# EAGLE design uv-exposure-box-main (EAGLE 6.4)
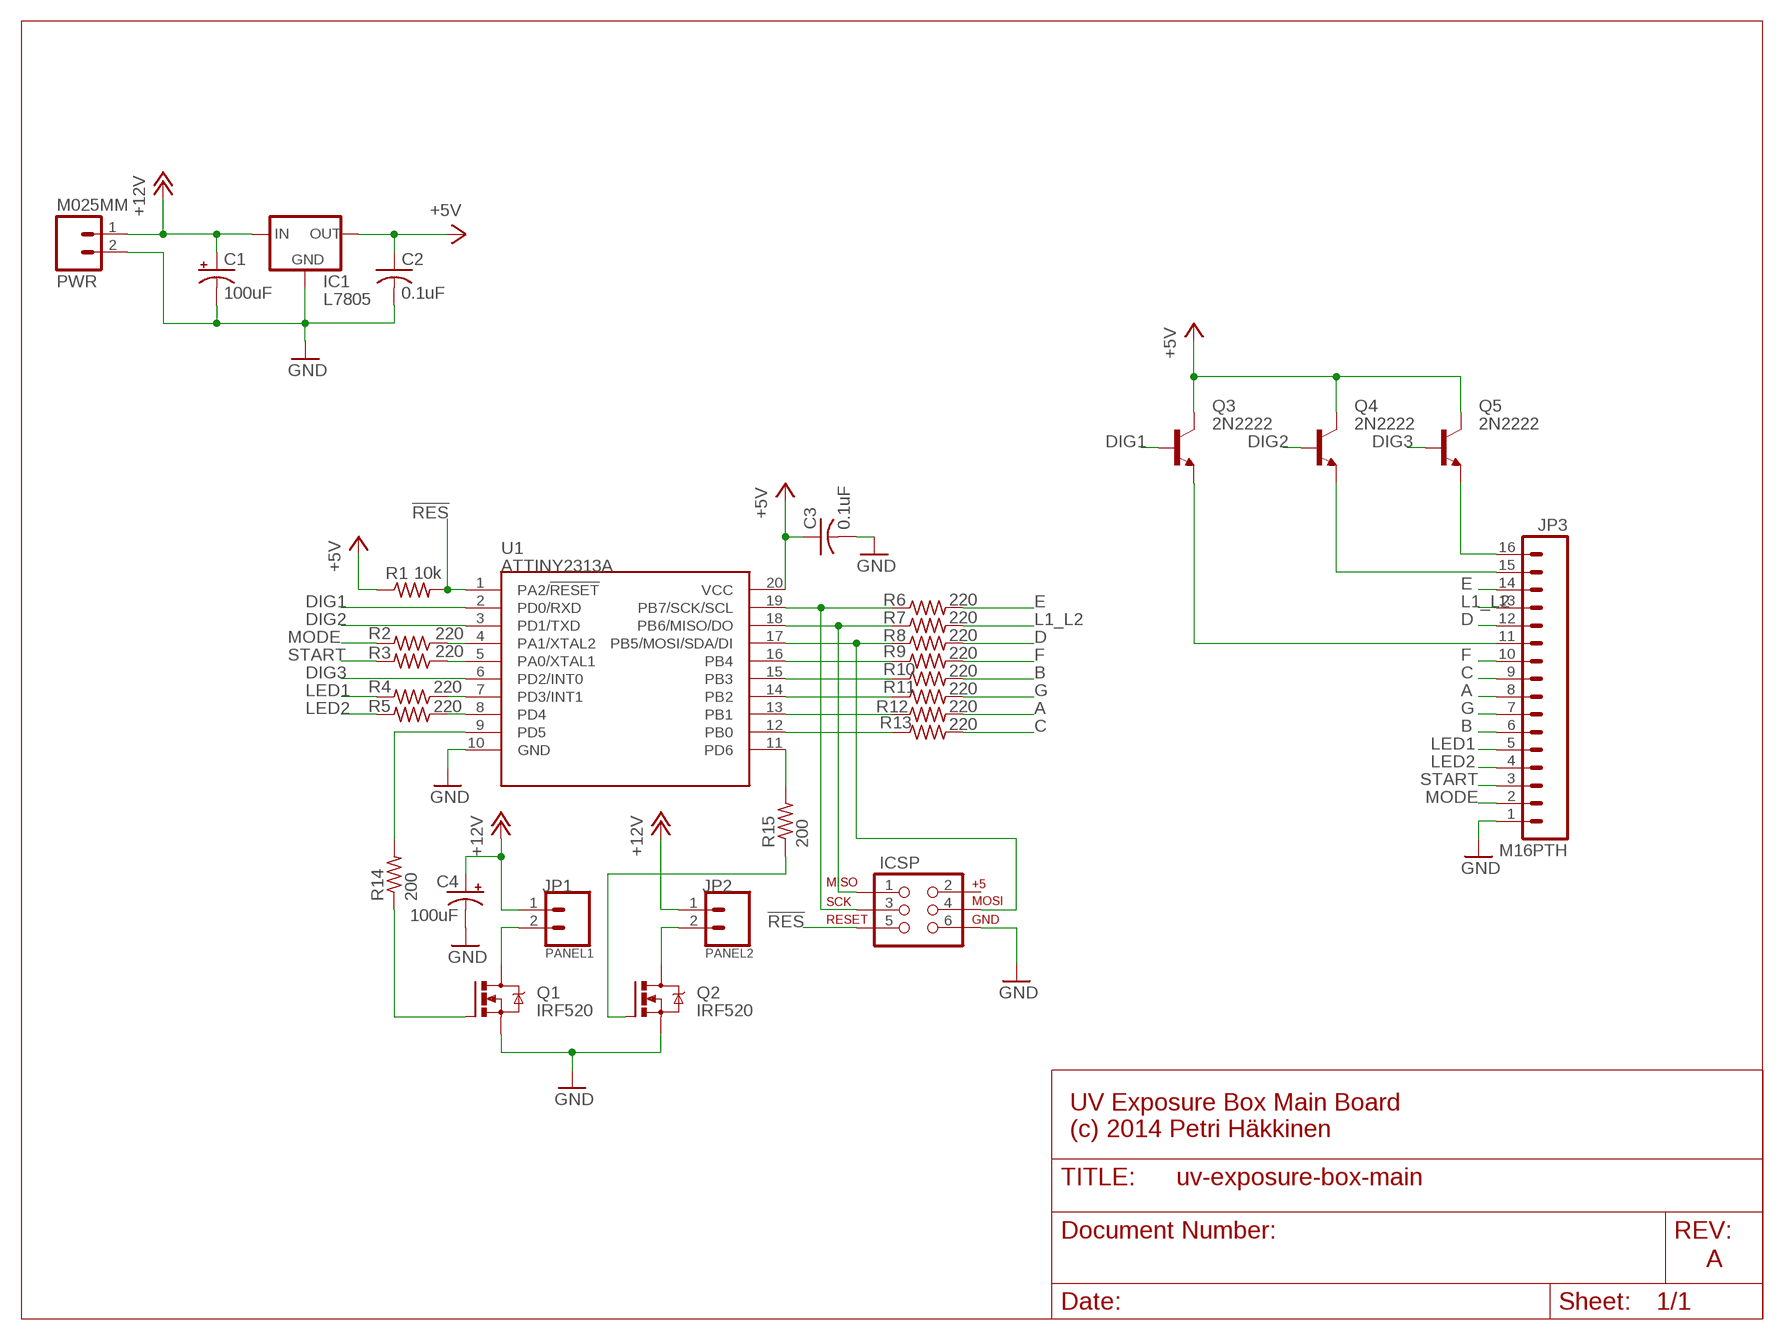
[diagram p0: schematic, sheet 1]

## Parts
C1  100uF  CPOL-USE2.5-5  [E2,5-5]
C2  0.1uF  C-US025-024X044  [C025-024X044]
C3  0.1uF  C-US025-024X044  [C025-024X044]
C4  100uF  CPOL-USE2.5-5  [E2,5-5]
IC1  L7805  V_REG_78XXV  [TO220-IGO]
ICSP  AVR_SPI_PRG_6PTH  [2X3]
JP1  M025MM  [SCREWTERMINAL-5MM-2]
JP2  M025MM  [SCREWTERMINAL-5MM-2]
JP3  M16PTH  [1X16]
PWR  M025MM  [SCREWTERMINAL-5MM-2]
Q1  IRF520  [TO220BV]
Q2  IRF520  [TO220BV]
Q3  2N2222  2N2222-NPN-TO92-EBC  [TO92-EBC]
Q4  2N2222  2N2222-NPN-TO92-EBC  [TO92-EBC]
Q5  2N2222  2N2222-NPN-TO92-EBC  [TO92-EBC]
R1  10k  R-US_0207/10  [0207/10]
R2  220  R-US_0207/10  [0207/10]
R3  220  R-US_0207/10  [0207/10]
R4  220  R-US_0207/10  [0207/10]
R5  220  R-US_0207/10  [0207/10]
R6  220  R-US_0207/10  [0207/10]
R7  220  R-US_0207/10  [0207/10]
R8  220  R-US_0207/10  [0207/10]
R9  220  R-US_0207/10  [0207/10]
R10  220  R-US_0207/10  [0207/10]
R11  220  R-US_0207/10  [0207/10]
R12  220  R-US_0207/10  [0207/10]
R13  220  R-US_0207/10  [0207/10]
R14  200  R-US_0207/10  [0207/10]
R15  200  R-US_0207/10  [0207/10]
U1  ATTINY2313A  ATTINY2313ADIL20  [DIL20]

## Nets
!RES: ICSP.5 R1.2 U1.1(PA2/!RESET)
+5V: C2.1 C3.1 IC1.OUT Q3.C Q4.C Q5.C R1.1 U1.20(VCC)
+12V: C1.+ C4.+ IC1.IN JP1.1 JP2.1 PWR.1
A: JP3.8 R12.2
B: JP3.6 R10.2
C: JP3.9 R13.2
D: JP3.12 R8.2
DIG1: Q3.B U1.2(PD0/RXD)
DIG2: Q4.B U1.3(PD1/TXD)
DIG3: Q5.B U1.6(PD2/INT0)
E: JP3.14 R6.2
F: JP3.10 R9.2
G: JP3.7 R11.2
GND: C1.- C2.2 C3.2 C4.- IC1.GND ICSP.6 JP3.1 PWR.2 Q1.S Q2.S U1.10(GND)
L1_L2: JP3.13 R7.2
LED1: JP3.5 R4.2
LED2: JP3.4 R5.2
MODE: JP3.2 R2.2
N$1: R2.1 U1.4(PA1/XTAL2)
N$2: R3.1 U1.5(PA0/XTAL1)
N$3: JP3.11 Q3.E
N$4: JP3.15 Q4.E
N$5: JP3.16 Q5.E
N$6: Q1.G R14.1
N$7: R15.2 U1.11(PD6)
N$9: ICSP.3 R6.1 U1.19(PB7/SCK/SCL)
N$10: ICSP.1 R7.1 U1.18(PB6/MISO/DO)
N$11: ICSP.4 R8.1 U1.17(PB5/MOSI/SDA/DI)
N$12: R9.1 U1.16(PB4)
N$13: R10.1 U1.15(PB3)
N$14: R11.1 U1.14(PB2)
N$15: R12.1 U1.13(PB1)
N$16: R13.1 U1.12(PB0)
N$26: R4.1 U1.7(PD3/INT1)
N$27: R5.1 U1.8(PD4)
N$28: R14.2 U1.9(PD5)
N$29: JP1.2 Q1.D
N$30: Q2.G R15.1
N$31: JP2.2 Q2.D
START: JP3.3 R3.2
Unconnected: ICSP.2

## Notes on the sheet
- PANEL1 | PANEL2
- UV Exposure Box Main Board
  (c) 2014 Petri Häkkinen
- A

## Library data of the parts
C1 C4 = resistor:CPOL-US: POLARIZED CAPACITOR, American symbol
C2 C3 = resistor:C-US: CAPACITOR, American symbol
IC1 = PetenPaja:V_REG_78XX: Voltage Regulator Standard 7805 5V regulator. IGO (Input Ground Output). Spark Fun Electronics SKU : COM-00107
ICSP = SparkFun-Connectors:AVR_SPI_PRG_6: AVR ISP 6 Pin This is the reduced ISP connector for AVR programming. Common on Arduino. This footprint will take up less PCB space and can be used with a 10-pin to 6-pin adapter such as SKU: BOB-08508
JP1 JP2 PWR = SparkFun-Connectors:M02: Standard 2-pin 0.1" header. Use with - straight break away headers ( PRT-00116) - right angle break away headers (PRT-00553) - swiss pins (PRT-00743) - machine pins (PRT-00117) - female headers (PRT-00115) Molex polarized connector foot print use with: PRT-08233 with associated crimp pins and housings. 2.54_SCREWTERM for use with PRT-10571. 3.5mm Screw Terminal footprints for PRT-08084 5mm Screw Terminal footprints for use with PRT-08433
JP3 = SparkFun-Connectors:M16: 1x16 .1" header
Q1 Q2 = PetenPaja:IRF520: HEXFET Power MOSFET
Q3-Q5 = transistor-neu-to92:*-NPN-: NPN Transistror
R1-R15 = resistor:R-US_: RESISTOR, American symbol
U1 = PetenPaja:ATTINY2313A: ATTINY2313A 2kB 20MHz I2C/SPI/UART

## Board
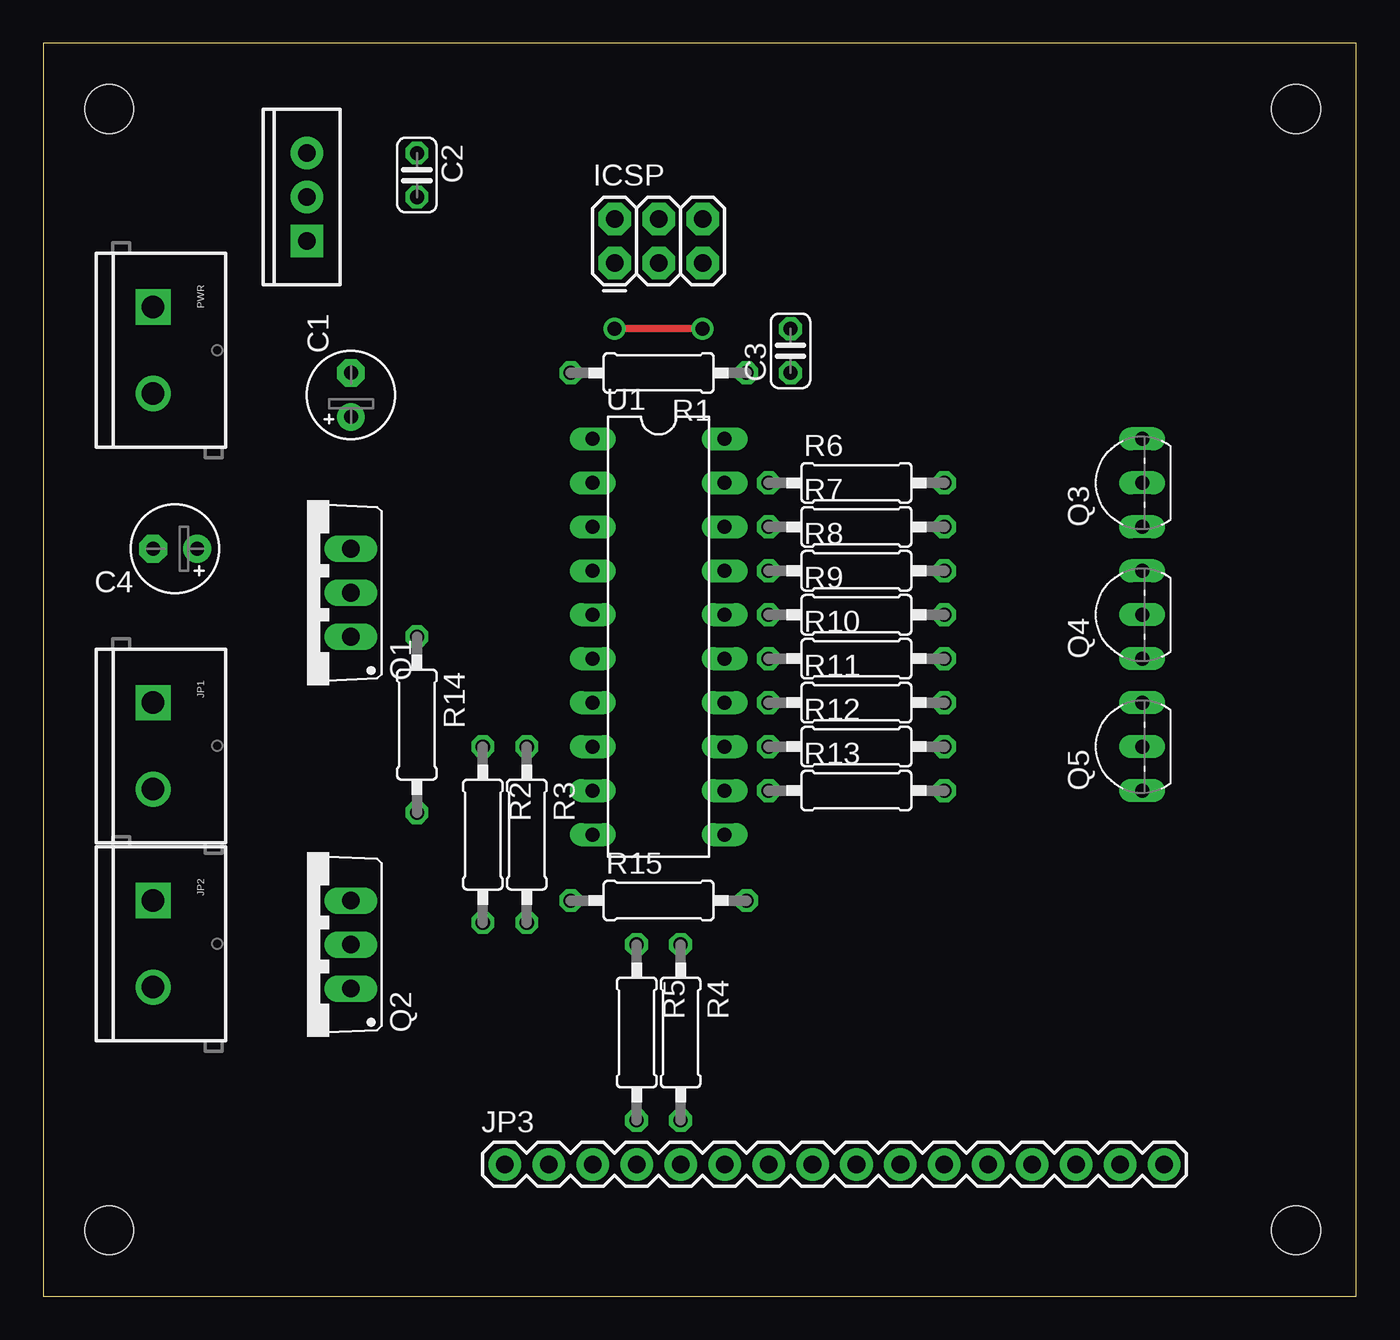
[diagram p1: board, top side]
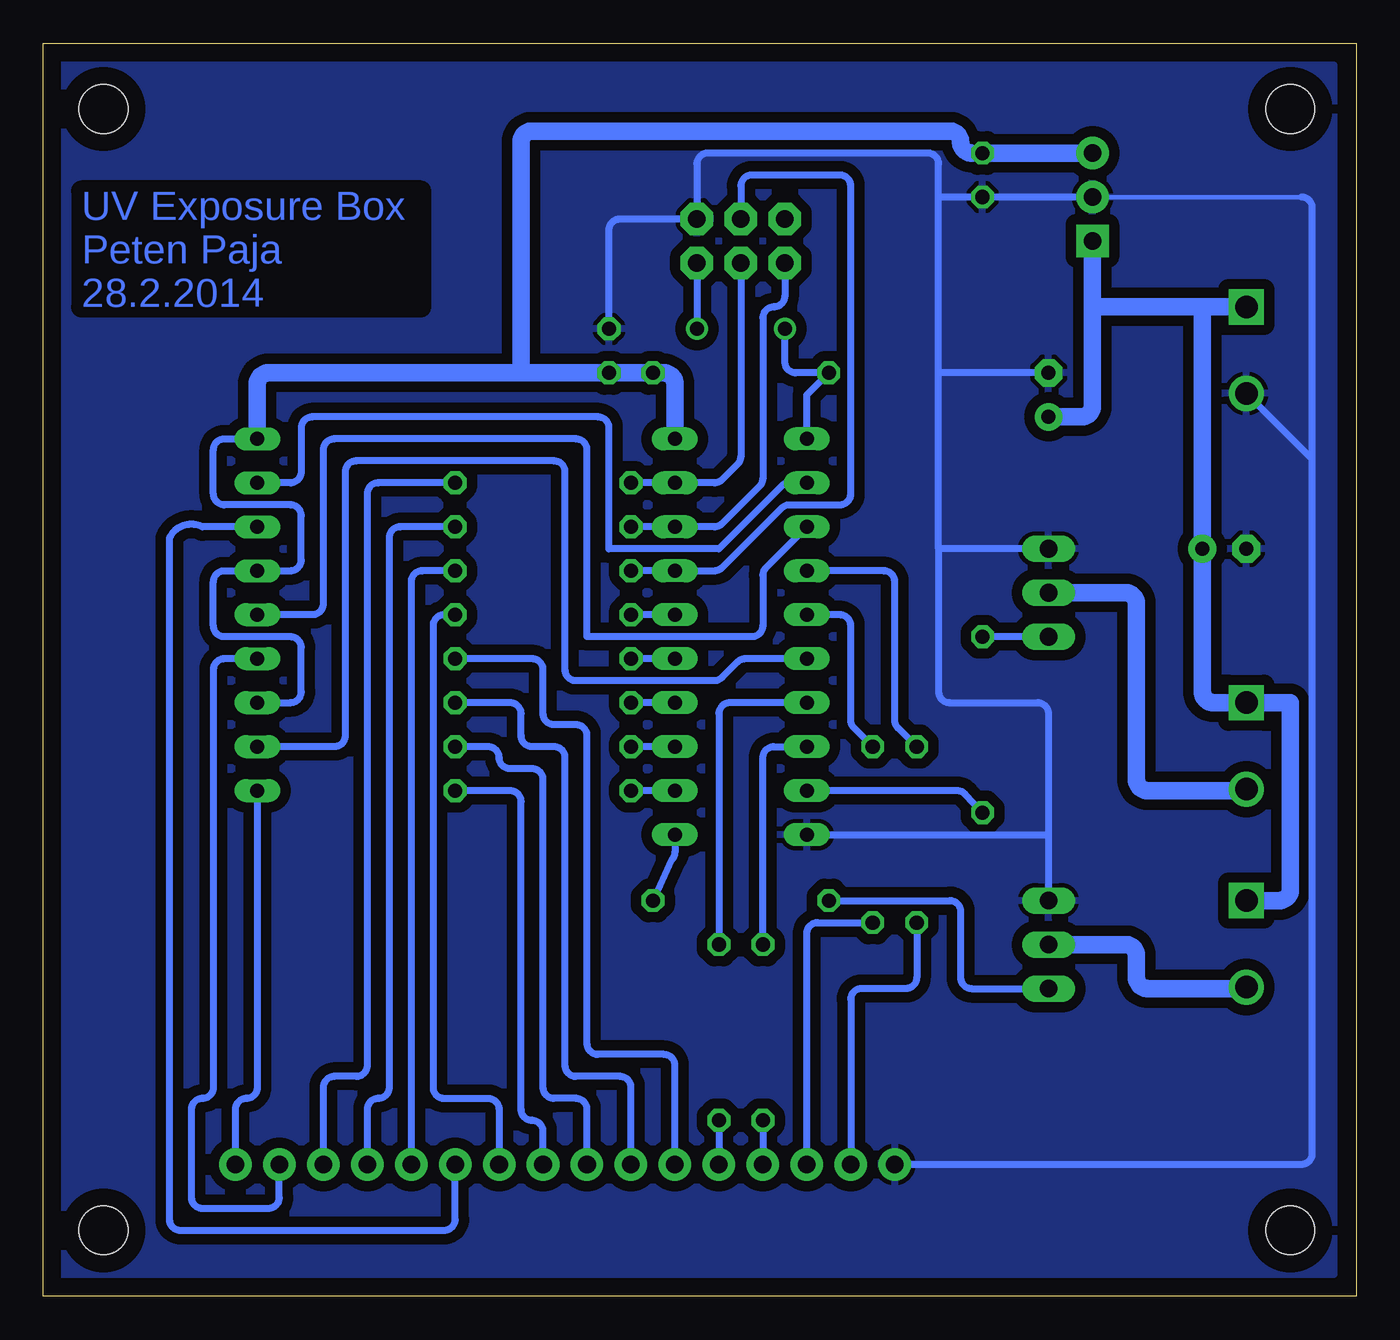
[diagram p2: board, bottom side, seen from below]

Size 75.87 x 72.38 mm. Coordinates in mm from the lower left corner, seen from the top.
Outline: 0,0 75.87,0 75.87,72.38 0,72.38 0,0
Copper layers (1*16): Top 0.035mm / dielectric 1.5mm / Bottom 0.035mm
Design rules "default": minimum track width 10mil, minimum drill 24mil, track to track 8mil, track to pad 8mil, pad to pad 8mil, via to via 8mil, smd to smd 8mil, copper to edge 40mil, drill to drill 8mil, minimum pad ring 10mil, minimum via ring 8mil, stop-mask expansion 4mil, vias tented up to drill 0mil, thermal gap 10mil
Holes 2.8 mm at 3.81,3.81 3.81,68.58 72.39,68.58 72.39,3.81

### Footprints (pad centres in the part's own frame; a part is rotated, then mirrored left to right if it is on the bottom)
E2,5-5 = drill 0.813 pad 1.6: + -1.27,0 | drill 0.813 pad 1.6 octagon: - 1.27,0
C025-024X044 = drill 0.813 octagon: 1 -1.27,0; 2 1.27,0
TO220-IGO = drill 1 pad 1.88: GND 0,0; OUT 2.54,0 | drill 1 pad 1.88 square: IN -2.54,0
2X3 = drill 1.016 pad 1.88 octagon: 1 0,0; 2 0,2.54; 3 2.54,0; 4 2.54,2.54; 5 5.08,0; 6 5.08,2.54
SCREWTERMINAL-5MM-2 = drill 1.3 pad 2.032 square: 1 0,0 | drill 1.3 pad 2.032: 2 5,0
1X16 = drill 1.016 pad 1.88: 1 0,0; 2 2.54,0; 3 5.08,0; 4 7.62,0; 5 10.16,0; 6 12.7,0; 7 15.24,0; 8 17.78,0; 9 20.32,0; 10 22.86,0; 11 25.4,0; 12 27.94,0; 13 30.48,0; 14 33.02,0; 15 35.56,0; 16 38.1,0
TO220BV = drill 1.016 long: D 0,-2.54; G -2.54,-2.54; S 2.54,-2.54
TO92-EBC = drill 0.813 long: B 0,-1.27; C 2.54,-1.27; E -2.54,-1.27
0207/10 = drill 0.813 octagon: 1 -5.08,0; 2 5.08,0
DIL20 = drill 0.813 long: 1 -11.43,-3.81; 2 -8.89,-3.81; 3 -6.35,-3.81; 4 -3.81,-3.81; 5 -1.27,-3.81; 6 1.27,-3.81; 7 3.81,-3.81; 8 6.35,-3.81; 9 8.89,-3.81; 10 11.43,-3.81; 11 11.43,3.81; 12 8.89,3.81; 13 6.35,3.81; 14 3.81,3.81; 15 1.27,3.81; 16 -1.27,3.81; 17 -3.81,3.81; 18 -6.35,3.81; 19 -8.89,3.81; 20 -11.43,3.81

### Placement (x,y rotation side)
C1  17.78,52.07 90 top
C2  21.59,64.77 270 top
C3  43.18,54.61 90 top
C4  7.62,43.18 180 top
IC1  15.24,63.5 90 top
ICSP  33.02,59.69 0 top
JP1  6.35,34.29 270 top
JP2  6.35,22.86 270 top
JP3  26.67,7.62 0 top
PWR  6.35,57.15 270 top
Q1  15.24,40.64 90 top
Q2  15.24,20.32 90 top
Q3  62.23,46.99 90 top
Q4  62.23,39.37 90 top
Q5  62.23,31.75 90 top
R1  35.56,53.34 180 top
R2  25.4,26.67 270 top
R3  27.94,26.67 270 top
R4  36.83,15.24 270 top
R5  34.29,15.24 270 top
R6  46.99,46.99 0 top
R7  46.99,44.45 0 top
R8  46.99,41.91 0 top
R9  46.99,39.37 0 top
R10  46.99,36.83 0 top
R11  46.99,34.29 0 top
R12  46.99,31.75 0 top
R13  46.99,29.21 0 top
R14  21.59,33.02 270 top
R15  35.56,22.86 0 top
U1  35.56,38.1 270 top

### Tracks (layer width: path | path; a pad name or v marks a point on that pad's centre or on a via)
!RES  (via drill 0.8 pad 1.27)
  Top 0.406: v38.1,55.88 v33.02,55.88
  Bottom 0.406: U1.1 31.75,52.07 R1.2 32.38,53.34 arc90 33.02,53.98 v33.02,55.88 | ICSP.5 v38.1,55.88
+5V
  Bottom 0.406: Q5.C 61.59,34.29 arc-90 60.96,34.92 60.96,37.47 arc-90 61.59,38.1 65.41,38.1 arc90 66.04,38.73 66.04,41.27 arc90 65.41,41.91 Q4.C 61.59,41.91 arc-90 60.96,42.55 60.96,45.09 arc-90 61.59,45.72 65.41,45.72 arc90 66.04,46.35 66.04,48.9 arc90 65.41,49.53 Q3.C | C2.1 22.23,66.04
  Bottom 1.016: U1.20 39.37,52.7 arc-90 40.01,53.34 R1.1 C3.1 48.26,53.34 | Q3.C 63.5,52.7 arc90 62.87,53.34 48.26,53.34 | 22.23,66.04 arc90 22.86,66.67 arc-90 23.5,67.31 47.62,67.31 arc-90 48.26,66.67 48.26,53.34 | IC1.OUT C2.1
+12V
  Bottom 1.016: JP2.1 4.45,22.86 arc-90 3.81,23.5 3.81,34.29 JP1.1 8.26,34.29 arc90 8.89,34.92 C4.+ 8.89,57.15 | PWR.1 8.89,57.15 | 8.89,57.15 15.24,57.15 | 15.24,57.15 15.24,51.44 arc90 15.88,50.8 C1.+ | IC1.IN 15.24,57.15
A
  Bottom 0.406: JP3.8 44.45,10.79 arc-90 45.09,11.43 46.35,11.43 arc90 46.99,12.06 46.99,29.84 arc-90 47.62,30.48 48.9,30.48 arc90 49.53,31.11 arc-90 50.16,31.75 R12.2
B
  Bottom 0.406: JP3.6 39.37,13.34 arc-90 40.01,13.97 43.81,13.97 arc90 44.45,14.61 44.45,32.38 arc-90 45.09,33.02 46.35,33.02 arc90 46.99,33.66 46.99,36.2 arc-90 47.62,36.83 R10.2
C
  Bottom 0.406: JP3.9 46.99,9.53 arc-90 47.62,10.16 arc90 48.26,10.79 48.26,28.57 arc-90 48.9,29.21 R13.2
D
  Bottom 0.406: R8.2 53.98,41.91 arc-90 54.61,41.27 JP3.12
DIG1
  Bottom 0.406: U1.2 32.76,46.99 arc-45 33.21,46.8 36.83,43.18 43.18,43.18 43.18,50.16 arc-90 43.81,50.8 60.33,50.8 arc-90 60.96,50.16 60.96,47.62 arc90 61.59,46.99 Q3.B
DIG2
  Bottom 0.406: U1.3 34.1,42.1 arc-45 34.29,41.65 34.29,38.73 arc90 34.92,38.1 44.45,38.1 44.45,48.9 arc-90 45.09,49.53 59.05,49.53 arc-90 59.69,48.9 59.69,40.01 arc90 60.33,39.37 Q4.B
DIG3
  Bottom 0.406: U1.6 35.3,36.83 arc-45 35.75,36.64 36.64,35.75 arc45 37.09,35.56 45.09,35.56 arc90 45.72,36.2 45.72,47.62 arc-90 46.35,48.26 57.78,48.26 arc-90 58.42,47.62 58.42,32.38 arc90 59.05,31.75 Q5.B
E
  Bottom 0.406: R6.2 56.52,46.99 arc-90 57.15,46.35 57.15,13.34 arc90 57.78,12.7 59.05,12.7 arc-90 59.69,12.06 JP3.14
F
  Bottom 0.406: R9.2 52.7,39.37 arc-90 53.34,38.73 53.34,12.06 arc-90 52.7,11.43 50.16,11.43 arc90 49.53,10.79 JP3.10
G
  Bottom 0.406: JP3.7 41.91,12.06 arc-90 42.55,12.7 45.09,12.7 arc90 45.72,13.34 45.72,31.11 arc-90 46.35,31.75 47.62,31.75 arc90 48.26,32.38 48.26,33.66 arc-90 48.9,34.29 R11.2
GND
  Bottom 0.254: 3.17,63.5 IC1.GND
  Bottom 0.406: JP3.1 3.17,7.62 arc-90 2.54,8.26 2.54,48.34 | 2.54,48.34 2.54,62.87 arc-90 3.17,63.5 | 24.13,53.34 24.13,63.5 | 24.13,63.5 24.13,65.41 arc-90 24.77,66.04 37.47,66.04 arc-90 38.1,65.41 ICSP.6 42.55,62.23 arc-90 43.18,61.59 C3.2 | Q1.S 24.13,43.18 | 17.78,26.67 17.78,33.66 arc-90 18.41,34.29 23.5,34.29 arc90 24.13,34.92 24.13,43.18 | 17.78,26.67 Q2.S | 24.13,43.18 24.13,53.34 | C1.- 24.13,53.34 | IC1.GND C2.2 24.13,63.5 | PWR.2 2.54,48.34 | U1.10 17.78,26.67
  pour Bottom (isolate 0.61): 1.27,71.12 74.93,71.12 74.93,69.85 74.93,1.27 1.27,1.27
L1_L2
  Bottom 0.406: R7.2 55.24,44.45 arc-90 55.88,43.81 55.88,12.06 arc90 56.52,11.43 arc-90 57.15,10.79 JP3.13
LED1
  Bottom 0.406: R4.2 JP3.5
LED2
  Bottom 0.406: R5.2 JP3.4
MODE
  Bottom 0.406: R2.2 25.4,18.41 arc90 26.04,17.78 28.57,17.78 arc-90 29.21,17.14 JP3.2
N$1
  Bottom 0.406: R2.1 26.48,32.83 arc45 26.67,33.28 26.67,41.27 arc-90 27.3,41.91 U1.4
N$2
  Bottom 0.406: R3.1 29.02,32.83 arc45 29.21,33.28 29.21,38.73 arc-90 29.84,39.37 U1.5
N$3
  Bottom 0.406: Q3.E 66.67,44.45 arc-90 68.58,43.81 68.58,4.45 arc-90 67.94,3.81 52.7,3.81 arc-90 52.07,4.45 JP3.11
N$4
  Bottom 0.406: Q4.E 65.41,36.83 arc-90 66.04,36.2 66.04,12.06 arc90 66.67,11.43 arc-90 67.31,10.79 67.31,5.71 arc-90 66.67,5.08 62.87,5.08 arc-90 62.23,5.71 JP3.15
N$5
  Bottom 0.406: Q5.E 63.5,12.06 arc90 64.14,11.43 arc-90 64.77,10.79 JP3.16
N$6
  Bottom 0.406: Q1.G R14.1
N$7
  Bottom 0.406: U1.11 39.37,25.66 arc45 39.56,25.21 R15.2
N$9
  Bottom 0.406: ICSP.3 35.56,48.52 arc45 35.75,48.07 36.64,47.18 arc45 37.09,46.99 U1.19 R6.1
N$10
  Bottom 0.406: ICSP.1 33.02,57.78 arc90 33.66,57.15 arc-90 34.29,56.52 34.29,47.25 arc45 34.48,46.8 36.64,44.64 arc45 37.09,44.45 U1.18 R7.1
N$11
  Bottom 0.406: R8.1 U1.17 37.09,41.91 arc-45 36.64,42.1 33.21,45.53 arc45 32.76,45.72 29.84,45.72 arc-90 29.21,46.35 29.21,64.14 arc-90 29.84,64.77 34.92,64.77 arc-90 35.56,64.14 ICSP.4
N$12
  Bottom 0.406: U1.16 R9.1
N$13
  Bottom 0.406: U1.15 R10.1
N$14
  Bottom 0.406: U1.14 R11.1
N$15
  Bottom 0.406: U1.13 R12.1
N$16
  Bottom 0.406: U1.12 R13.1
N$20
  pour Bottom (isolate 0.61): 1.27,71.12 74.93,71.12 74.93,1.27 1.27,1.27
N$26
  Bottom 0.406: U1.7 36.2,34.29 arc-90 36.83,33.66 R4.1
N$27
  Bottom 0.406: R5.1 34.29,31.11 arc90 33.66,31.75 U1.8
N$28
  Bottom 0.406: R14.2 22.6,29.01 arc-47 23.06,29.21 U1.9
N$29
  Bottom 0.406: 6.43,29.21 arc-90 JP1.2
  Bottom 1.016: 6.43,29.21 12.06,29.21 arc90 12.7,29.84 12.7,40.01 arc-90 13.34,40.64 Q1.D
N$30
  Bottom 0.406: R15.1 23.5,22.86 arc90 22.86,22.23 22.86,18.41 arc-90 22.23,17.78 Q2.G
N$31
  Bottom 0.406: 6.43,17.78 arc-90 JP2.2
  Bottom 1.016: Q2.D 13.34,20.32 arc90 12.7,19.68 12.7,18.41 arc-90 12.06,17.78 6.43,17.78
START
  Bottom 0.406: JP3.3 31.75,20.95 arc90 31.11,21.59 R3.2

### Text on the board
Bottom: UV Exposure Box / Peten Paja / 28.2.2014